# Altium schematic sheet WiFi.SchDoc: WiFi Module
size A4; DrawnBy: A. Küllenberg; Revision: A; SheetNumber: 8; SheetTotal: 10
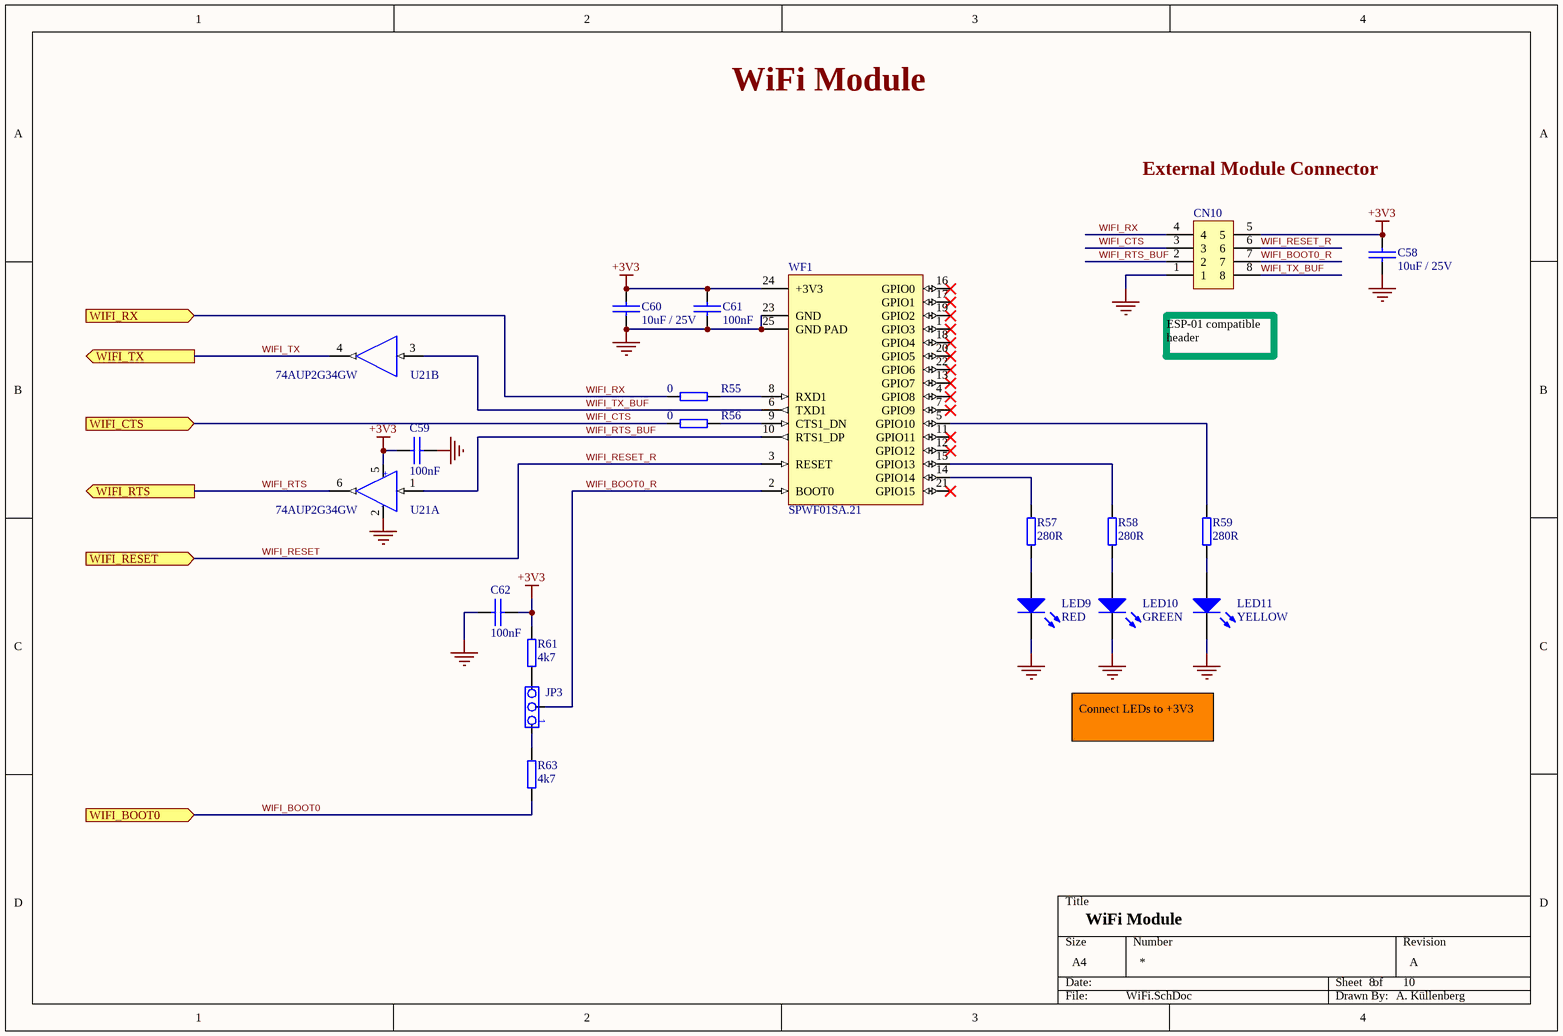
[diagram p0: WiFi.SchDoc]

## Parts
C58  10uF / 25V  [C0603]
C59  100nF  [C0603]
C60  10uF / 25V  [C0603]
C61  100nF  [C0603]
C62  100nF  [C0603]
CN10  HDR 2x4  [PPPC042LFBN-RC]  (value not drawn)
JP3  JP  [HDR1x3]  (value not drawn)
LED9  RED  [LED_0603_RED]
LED10  GREEN  [LED_0603_GREEN]
LED11  YELLOW  [LED_0603_YELLOW]
R55  0  [R0603]
R56  0  [R0603]
R57  280R  [R0603]
R58  280R  [R0603]
R59  280R  [R0603]
R61  4k7  [R0603]
R63  4k7  [R0603]
U21  74AUP2G34GW  [SOT363]  (parts A,B of 2)
WF1  SPWF01SA.21  [SPWF01SA]

## Ports
WIFI_BOOT0 (in), WIFI_CTS (in), WIFI_RESET (in), WIFI_RTS (out), WIFI_RX (in), WIFI_TX (out)

## Nets
+3V3: C58.2 C59.2 C60.2 C61.2 C62.1 CN10.5 R61.2 U21.5 WF1.24(+3V3)
GND: C58.1 C59.1 C60.1 C61.1 C62.2 CN10.1 LED9.2(K) LED10.2(K) LED11.2(K) U21.2 WF1.23(GND) WF1.25(GND_PAD)
WIFI_BOOT0: R63.1 ; port WIFI_BOOT0
WIFI_BOOT0_R: CN10.7 JP3.2 WF1.2(BOOT0)
WIFI_CTS: CN10.3 R56.1 ; port WIFI_CTS
WIFI_RESET: CN10.6 WF1.3(RESET) ; port WIFI_RESET  [also labelled WIFI_RESET_R]
WIFI_RTS: U21.6 ; port WIFI_RTS
WIFI_RTS_BUF: CN10.2 U21.1 WF1.10(RTS1_DP)
WIFI_RX: CN10.4 R55.1 ; port WIFI_RX
WIFI_TX: U21.4 ; port WIFI_TX
WIFI_TX_BUF: CN10.8 U21.3 WF1.6(TXD1)
NetJP3_1: JP3.1 R63.2
NetJP3_3: JP3.3 R61.1
NetLED9_1: LED9.1(A) R57.1
NetLED10_1: LED10.1(A) R58.1
NetLED11_1: LED11.1(A) R59.1
NetR55_2: R55.2 WF1.8(RXD1)
NetR56_2: R56.2 WF1.9(CTS1_DN)
NetR57_2: R57.2 WF1.14(GPIO14)
NetR58_2: R58.2 WF1.15(GPIO13)
NetR59_2: R59.2 WF1.5(GPIO10)

Not connected (* = marked no-connect by the designer): WF1 1(GPIO3)* 4(GPIO8)* 7(GPIO9)* 11(GPIO11)* 12(GPIO12)* 13(GPIO7)* 16(GPIO0)* 17(GPIO1)* 18(GPIO4)* 19(GPIO2)* 20(GPIO5)* 21(GPIO15)* 22(GPIO6)*

## Notes on the sheet
- WiFi Module
- External Module Connector
- (near CN10) ESP-01 compatible header
- Connect LEDs to +3V3
- (in symbol 74AUP2G34GW,125, part A) +; -

## Library data of the parts
C58 C60 = ZRB18AR61E106ME01L: CAP CER 10UF 25V X5R 0603; Manufacturer: Murata Electronics North America; Capacitance: 10µF; Tolerance: ±20%; Part Number: ZRB18AR61E106ME01L; Value: 10uF / 25V; Supplier 1: Digi-Key; Supplier Part Number 1: 490-10991-1-ND; Manufacturer Part Number: ZRB18AR61E106ME01L; RoHS: RoHS Compliant; Category: Capacitors; Stock 1: 23575; Pricing 1: 1=0.4, 10=0.278, 25=0.2284, 50=0.195, 100=0.1671, 250=0.13924, 500=0.12532, 1000=0.10583 (EUR); Packaging: Cut Tape (CT); Voltage - Rated: 25V; Temperature Coefficient: X5R; Mounting Type: Surface Mount, MLCC; Operating Temperature: -55°C ~ 85°C; Applications: Acoustic Noise Reduction; Ratings: -; Package / Case: 0603 (1608 Metric); Size / Dimension: 0.063" L x 0.031" W (1.60mm x 0.80mm); Height - Seated (Max): -; Thickness (Max): 0.047" (1.20mm); Lead Spacing: -; Features: Interposer Termination; Lead Style: -; ComponentLink1URL: http://search.murata.co.jp/Ceramy/image/img/A01X/G101/ENG/ZRB18AR61E106ME01-01.pdf; ComponentLink1Description: http://search.murata.co.jp/Ceramy/image/img/A01X/G101/ENG/ZRB18AR61E106ME01-01.pdf; Part Status: Active
C59 C61 C62 = C0603C104K5RACTU: CAP CER 0.1UF 50V X7R 0603; Manufacturer: Kemet; Capacitance: 0.10µF; Tolerance: ±10%; Part Number: C0603C104K5RACTU; Value: 100nF; Supplier 1: Digi-Key; Supplier Part Number 1: 399-5089-1-ND; Manufacturer Part Number: C0603C104K5RACTU; RoHS: RoHS Compliant; Category: Capacitors; Stock 1: 1628757; Pricing 1: 1=0.09, 10=0.037, 50=0.0198, 100=0.0167, 250=0.01372, 500=0.01174, 1000=0.00914 (EUR); Packaging: Cut Tape (CT); Voltage - Rated: 50V; Temperature Coefficient: X7R; Mounting Type: Surface Mount, MLCC; Operating Temperature: -55°C ~ 125°C; Applications: General Purpose; Ratings: -; Package / Case: 0603 (1608 Metric); Size / Dimension: 0.063" L x 0.031" W (1.60mm x 0.80mm); Height - Seated (Max): -; Thickness (Max): 0.034" (0.87mm); Lead Spacing: -; Features: -; Lead Style: -; ComponentLink1URL: http://www.kemet.com/docfinder?Partnumber=C0603C104K5RACTU; ComponentLink1Description: http://www.kemet.com/docfinder?Partnumber=C0603C104K5RACTU
CN10 = PPPC042LFBN-RC: CONN HEADER FMAL 8PS .1" DL GOLD; Manufacturer: Sullins Connector Solutions; Number of Positions: 8; Number of Positions Loaded: All; Current Rating: 3A; Voltage Rating: 250V; Pitch - Mating: 0.100" (2.54mm); Style: Board to Board; Contact Length - Post: 0.126" (3.20mm); Material Flammability Rating: UL94 V-0; Part Number: PPPC042LFBN-RC; Value: HDR 2x4; Supplier 1: Digi-Key; Supplier Part Number 1: S7107-ND; Manufacturer Part Number: PPPC042LFBN-RC; RoHS: RoHS Compliant; Category: Connectors, Interconnects; Stock 1: 5335; Pricing 1: 1=0.8, 10=0.667, 25=0.6172, 50=0.5556, 100=0.4938, 250=0.43208, 500=0.39502, 1000=0.35799, 2500=0.32096 (EUR); Packaging: Bulk; Connector Type: Header; Contact Type: Female Socket; Number of Rows: 2; Mounting Type: Through Hole; Termination: Solder; Fastening Type: Push-Pull; Features: -; ComponentLink1URL: http://www.sullinscorp.com/drawings/78_P(N)PxCxxxLFBN-RC,_10492-H.pdf; ComponentLink1Description: http://www.sullinscorp.com/drawings/78_P(N)PxCxxxLFBN-RC,_10492-H.pdf; Contact Material: Phosphor Bronze; Operating Temperature: -40°C ~ 105°C; Part Status: Active; Row Spacing - Mating: 0.100" (2.54mm); Contact Finish - Mating: Gold; Contact Finish Thickness - Mating: Flash; Insulation Color: Black; Insulation Height: 0.335" (8.51mm); Contact Shape: Square; Ingress Protection: -; Contact Finish - Post: Gold; Insulation Material: Polyester; Mated Stacking Heights: -; Contact Finish Thickness - Post: Flash; Applications: -
JP3 = 61300311121: CONN HEADER 3 POS 2.54; Manufacturer: Wurth Electronics Inc.; Pitch - Mating: 0.100" (2.54mm); Style: Board to Board or Cable; Shrouding: Unshrouded; Number of Positions: 3; Number of Positions Loaded: All; Contact Length - Mating: 0.236" (6.00mm); Contact Length - Post: 0.118" (3.00mm); Overall Contact Length: 0.454" (11.54mm); Material Flammability Rating: UL94 V-0; Current Rating: 3A; Voltage Rating: 250V; Part Number: 61300311121; Value: JP; Supplier 1: Digi-Key; Supplier Part Number 1: 732-5316-ND; Manufacturer Part Number: 61300311121; RoHS: RoHS Compliant; Category: Connectors, Interconnects; Stock 1: 31558; Pricing 1: 1=0.21, 10=0.191, 25=0.1628, 50=0.1424, 100=0.1323, 1000=0.09157 (EUR); Packaging: Bulk; Part Status: Active; Connector Type: Header; Contact Type: Male Pin; Number of Rows: 1; Row Spacing - Mating: -; Mounting Type: Through Hole; Termination: Solder; Fastening Type: -; Insulation Height: 0.100" (2.54mm); Contact Shape: Square; Contact Finish - Mating: Gold; Contact Finish Thickness - Mating: -; Contact Finish - Post: -; Contact Material: Copper Alloy; Insulation Material: Polybutylene Terephthalate (PBT); Features: -; Operating Temperature: -40°C ~ 125°C; Ingress Protection: -; Insulation Color: Black; Mated Stacking Heights: -; Contact Finish Thickness - Post: -; Applications: -; ComponentLink1URL: http://katalog.we-online.de/em/datasheet/6130xx11121.pdf; ComponentLink1Description: http://katalog.we-online.de/em/datasheet/6130xx11121.pdf
LED9 = LTST-C190KRKT: LED RED CLEAR 0603 SMD; Manufacturer: Lite-On Inc.; Voltage - Forward (Vf) (Typ): 2V; Viewing Angle: 130°; Wavelength - Dominant: 631nm; Wavelength - Peak: 639nm; Millicandela Rating: 99mcd; Current - Test: 20mA; Lens Color: Colorless; Lens Style/Size: Rectangle with Flat Top, 1.10mm x 0.80mm; Part Number: LTST-C190KRKT; Value: RED; Supplier 1: Digi-Key; Supplier Part Number 1: 160-1436-1-ND; Manufacturer Part Number: LTST-C190KRKT; RoHS: RoHS Compliant; Category: Optoelectronics; Stock 1: 1183099; Pricing 1: 1=0.24, 10=0.176, 25=0.1296, 100=0.0926, 250=0.063, 500=0.05556, 1000=0.04353 (EUR); Packaging: Cut Tape (CT); Mounting Type: Surface Mount; Package / Case: 0603 (1608 Metric); ComponentLink1URL: http://optoelectronics.liteon.com/upload/download/DS-22-99-0151/S_110_LTST-C190KRKT.pdf; ComponentLink1Description: http://optoelectronics.liteon.com/upload/download/DS-22-99-0151/S_110_LTST-C190KRKT.pdf; Supplier Device Package: *; Color: Red; Lens Transparency: Clear; Size / Dimension: 1.60mm L x 0.80mm W; Height (Max): 0.80mm; Features: -
LED10 = LTST-C190KGKT: LED GREEN CLEAR 0603 SMD; Manufacturer: Lite-On Inc.; Voltage - Forward (Vf) (Typ): 2V; Viewing Angle: 130°; Wavelength - Dominant: 571nm; Wavelength - Peak: 574nm; Millicandela Rating: 35mcd; Current - Test: 20mA; Lens Color: Colorless; Lens Style/Size: Rectangle with Flat Top, 1.10mm x 0.80mm; Part Number: LTST-C190KGKT; Value: GREEN; Supplier 1: Digi-Key; Supplier Part Number 1: 160-1435-1-ND; Manufacturer Part Number: LTST-C190KGKT; RoHS: RoHS Compliant; Category: Optoelectronics; Stock 1: 1245030; Pricing 1: 1=0.24, 10=0.176, 25=0.1296, 100=0.0926, 250=0.063, 500=0.05556, 1000=0.04353 (EUR); Packaging: Cut Tape (CT); Mounting Type: Surface Mount; Package / Case: 0603 (1608 Metric); ComponentLink1URL: http://optoelectronics.liteon.com/upload/download/DS22-2000-074/S_110_LTST-C190KGKT.pdf; ComponentLink1Description: http://optoelectronics.liteon.com/upload/download/DS22-2000-074/S_110_LTST-C190KGKT.pdf; Supplier Device Package: *; Color: Green; Lens Transparency: Clear; Size / Dimension: 1.60mm L x 0.80mm W; Height (Max): 0.80mm; Features: -
LED11 = LTST-C190KSKT: LED YELLOW CLEAR 0603 SMD; Manufacturer: Lite-On Inc.; Voltage - Forward (Vf) (Typ): 2.1V; Viewing Angle: 130°; Wavelength - Dominant: 591nm; Wavelength - Peak: 588nm; Millicandela Rating: 104mcd; Current - Test: 20mA; Lens Color: Colorless; Lens Style/Size: Rectangle with Flat Top, 1.10mm x 0.80mm; Part Number: LTST-C190KSKT; Value: YELLOW; Supplier 1: Digi-Key; Supplier Part Number 1: 160-1437-1-ND; Manufacturer Part Number: LTST-C190KSKT; RoHS: RoHS Compliant; Category: Optoelectronics; Stock 1: 229638; Pricing 1: 1=0.27, 10=0.199, 25=0.1468, 100=0.1049, 250=0.07132, 500=0.06292, 1000=0.0493 (EUR); Packaging: Cut Tape (CT); Mounting Type: Surface Mount; Package / Case: 0603 (1608 Metric); ComponentLink1URL: http://optoelectronics.liteon.com/upload/download/DS-22-99-0189/S_110_LTST-C190KSKT.pdf; ComponentLink1Description: http://optoelectronics.liteon.com/upload/download/DS-22-99-0189/S_110_LTST-C190KSKT.pdf; Color: Yellow; Lens Transparency: Clear; Size / Dimension: 1.60mm L x 0.80mm W; Height (Max): 0.80mm; Features: -; Part Status: Active
R55 R56 = RC0603JR-070RL: RES SMD 0.0OHM JUMPER 1/10W 0603; Manufacturer: Yageo; Resistance (Ohms): 0.0; Power (Watts): 0.1W, 1/10W; Part Number: RC0603JR-070RL; Value: 0; Manufacturer Part Number: RC0603JR-070RL; RoHS: RoHS Compliant; Category: Resistors; Stock 1: 12194512; Pricing 1: 1=0.09, 10=0.009, 25=0.0072, 50=0.0052, 100=0.0039, 250=0.003, 500=0.0024, 1000=0.00176 (EUR); Packaging: Cut Tape (CT); Tolerance: Jumper; Composition: Thick Film; Features: Moisture Resistant; Temperature Coefficient: -; Operating Temperature: -55°C ~ 155°C; Package / Case: 0603 (1608 Metric); Supplier Device Package: 0603; Size / Dimension: 0.063" L x 0.031" W (1.60mm x 0.80mm); ComponentLink1URL: http://www.yageo.com/documents/recent/PYu-RC_Group_51_RoHS_L_7.pdf; ComponentLink1Description: http://www.yageo.com/documents/recent/PYu-RC_Group_51_RoHS_L_7.pdf; Supplier 1: Digi-Key; Supplier Part Number 1: 311-0.0GRCT-ND; Height - Seated (Max): 0.022" (0.55mm); Part Status: Active; Failure Rate: -
R57-R59 = RC0603FR-07280RL: RES SMD 280 OHM 1% 1/10W 0603; Manufacturer: Yageo; Resistance (Ohms): 280; Power (Watts): 0.1W, 1/10W; Temperature Coefficient: ±100ppm/°C; Part Number: RC0603FR-07280RL; Value: 280R; Manufacturer Part Number: RC0603FR-07280RL; RoHS: RoHS Compliant; Category: Resistors; Stock 1: 47; Pricing 1: 1=0.09, 10=0.012, 25=0.0088, 50=0.0066, 100=0.0049, 250=0.00372, 500=0.00298, 1000=0.0022 (EUR); Packaging: Cut Tape (CT); Tolerance: ±1%; Composition: Thick Film; Features: Moisture Resistant; Operating Temperature: -55°C ~ 155°C; Package / Case: 0603 (1608 Metric); Supplier Device Package: 0603; Size / Dimension: 0.063" L x 0.031" W (1.60mm x 0.80mm); ComponentLink1URL: http://www.yageo.com/documents/recent/PYu-RC_Group_51_RoHS_L_6.pdf; ComponentLink1Description: http://www.yageo.com/documents/recent/PYu-RC_Group_51_RoHS_L_6.pdf; Supplier 1: Digi-Key; Supplier Part Number 1: 311-280HRCT-ND; Height - Seated (Max): 0.022" (0.55mm); Part Status: Active; Failure Rate: -
R61 R63 = CRCW06034K70FKEA: RES SMD 4.7K OHM 1% 1/10W 0603; Manufacturer: Vishay Dale; Power (Watts): 0.1W, 1/10W; Temperature Coefficient: ±100ppm/°C; Part Number: CRCW06034K70FKEA; Value: 4k7; Manufacturer Part Number: CRCW06034K70FKEA; RoHS: RoHS Compliant; Category: Resistors; Stock 1: 324271; Pricing 1: 1=0.09, 10=0.027, 25=0.0196, 50=0.015, 100=0.011, 250=0.0084, 500=0.00674, 1000=0.00496, 2500=0.00431 (EUR); Packaging: Cut Tape (CT); Resistance (Ohms): 4.7k; Tolerance: ±1%; Composition: Thick Film; Features: Automotive AEC-Q200; Operating Temperature: -55°C ~ 155°C; Package / Case: 0603 (1608 Metric); Supplier Device Package: 0603; Size / Dimension: 0.061" L x 0.033" W (1.55mm x 0.85mm); Height: 0.020" (0.50mm); Number of Terminations: 2; ComponentLink1URL: http://www.vishay.com/docs/20035/dcrcwe3.pdf; ComponentLink1Description: http://www.vishay.com/docs/20035/dcrcwe3.pdf; Supplier 1: Digi-Key; Supplier Part Number 1: 541-4.70KHCT-ND
U21 = 74AUP2G34GW,125: IC BUFF DL LOW PWR N-INV 6TSSOP; Manufacturer: Nexperia USA Inc.; Logic Type: Buffer, Non-Inverting; Number of Bits per Element: 1; Part Number: 74AUP2G34GW,125; Value: 74AUP2G34GW; Supplier 1: Digi-Key; Supplier Part Number 1: 1727-3208-1-ND; Manufacturer Part Number: 74AUP2G34GW,125; RoHS: RoHS Compliant; Category: Integrated Circuits (ICs); Stock 1: 4222; Pricing 1: 1=0.44, 10=0.376, 100=0.2804, 500=0.2203, 1000=0.17023 (EUR); Packaging: Cut Tape (CT); Part Status: Active
WF1 = SPWF01SA.21: RF TXRX MODULE WIFI CHIP ANT; Manufacturer: STMicroelectronics; Protocol: 802.11b/g/n; Modulation: DSSS, OFDM; Frequency: 2.4GHz; Data Rate: 65Mbps; Power - Output: 18.3dBm; Sensitivity: -96dBm; Serial Interfaces: UART; Antenna Type: Integrated, Chip; Memory Size: 512kB Flash, 64kB RAM; Voltage - Supply: 3.3V; Current - Receiving: 105mA; Current - Transmitting: 210mA ~ 344mA; Part Number: SPWF01SA.21; Value: SPWF01SA.21; Packaging: Tray; Supplier 1: Digi-Key; Supplier Part Number 1: 497-14638-ND; Manufacturer Part Number: SPWF01SA.21; Pricing 1: 1=15.26, 10=13.811, 100=11.6301, 500=10.17632 (EUR); RoHS: RoHS Compliant; Category: RF/IF and RFID; Stock 1: 182; Part Status: Active; RF Family/Standard: WiFi; Mounting Type: Surface Mount; Operating Temperature: -40°C ~ 85°C; Package / Case: Module; ComponentLink1URL: http://www.st.com/content/ccc/resource/technical/document/datasheet/ba/8c/b2/64/02/bc/4e/05/DM00102124.pdf/files/DM00102124.pdf/jcr:content/translations/en.DM00102124.pdf; ComponentLink1Description: http://www.st.com/content/ccc/resource/technical/document/datasheet/ba/8c/b2/64/02/bc/4e/05/DM00102124.pdf/files/DM00102124.pdf/jcr:content/translations/en.DM00102124.pdf